# EAGLE design sensorboard_atm_rev1 (EAGLE 6.5.0)
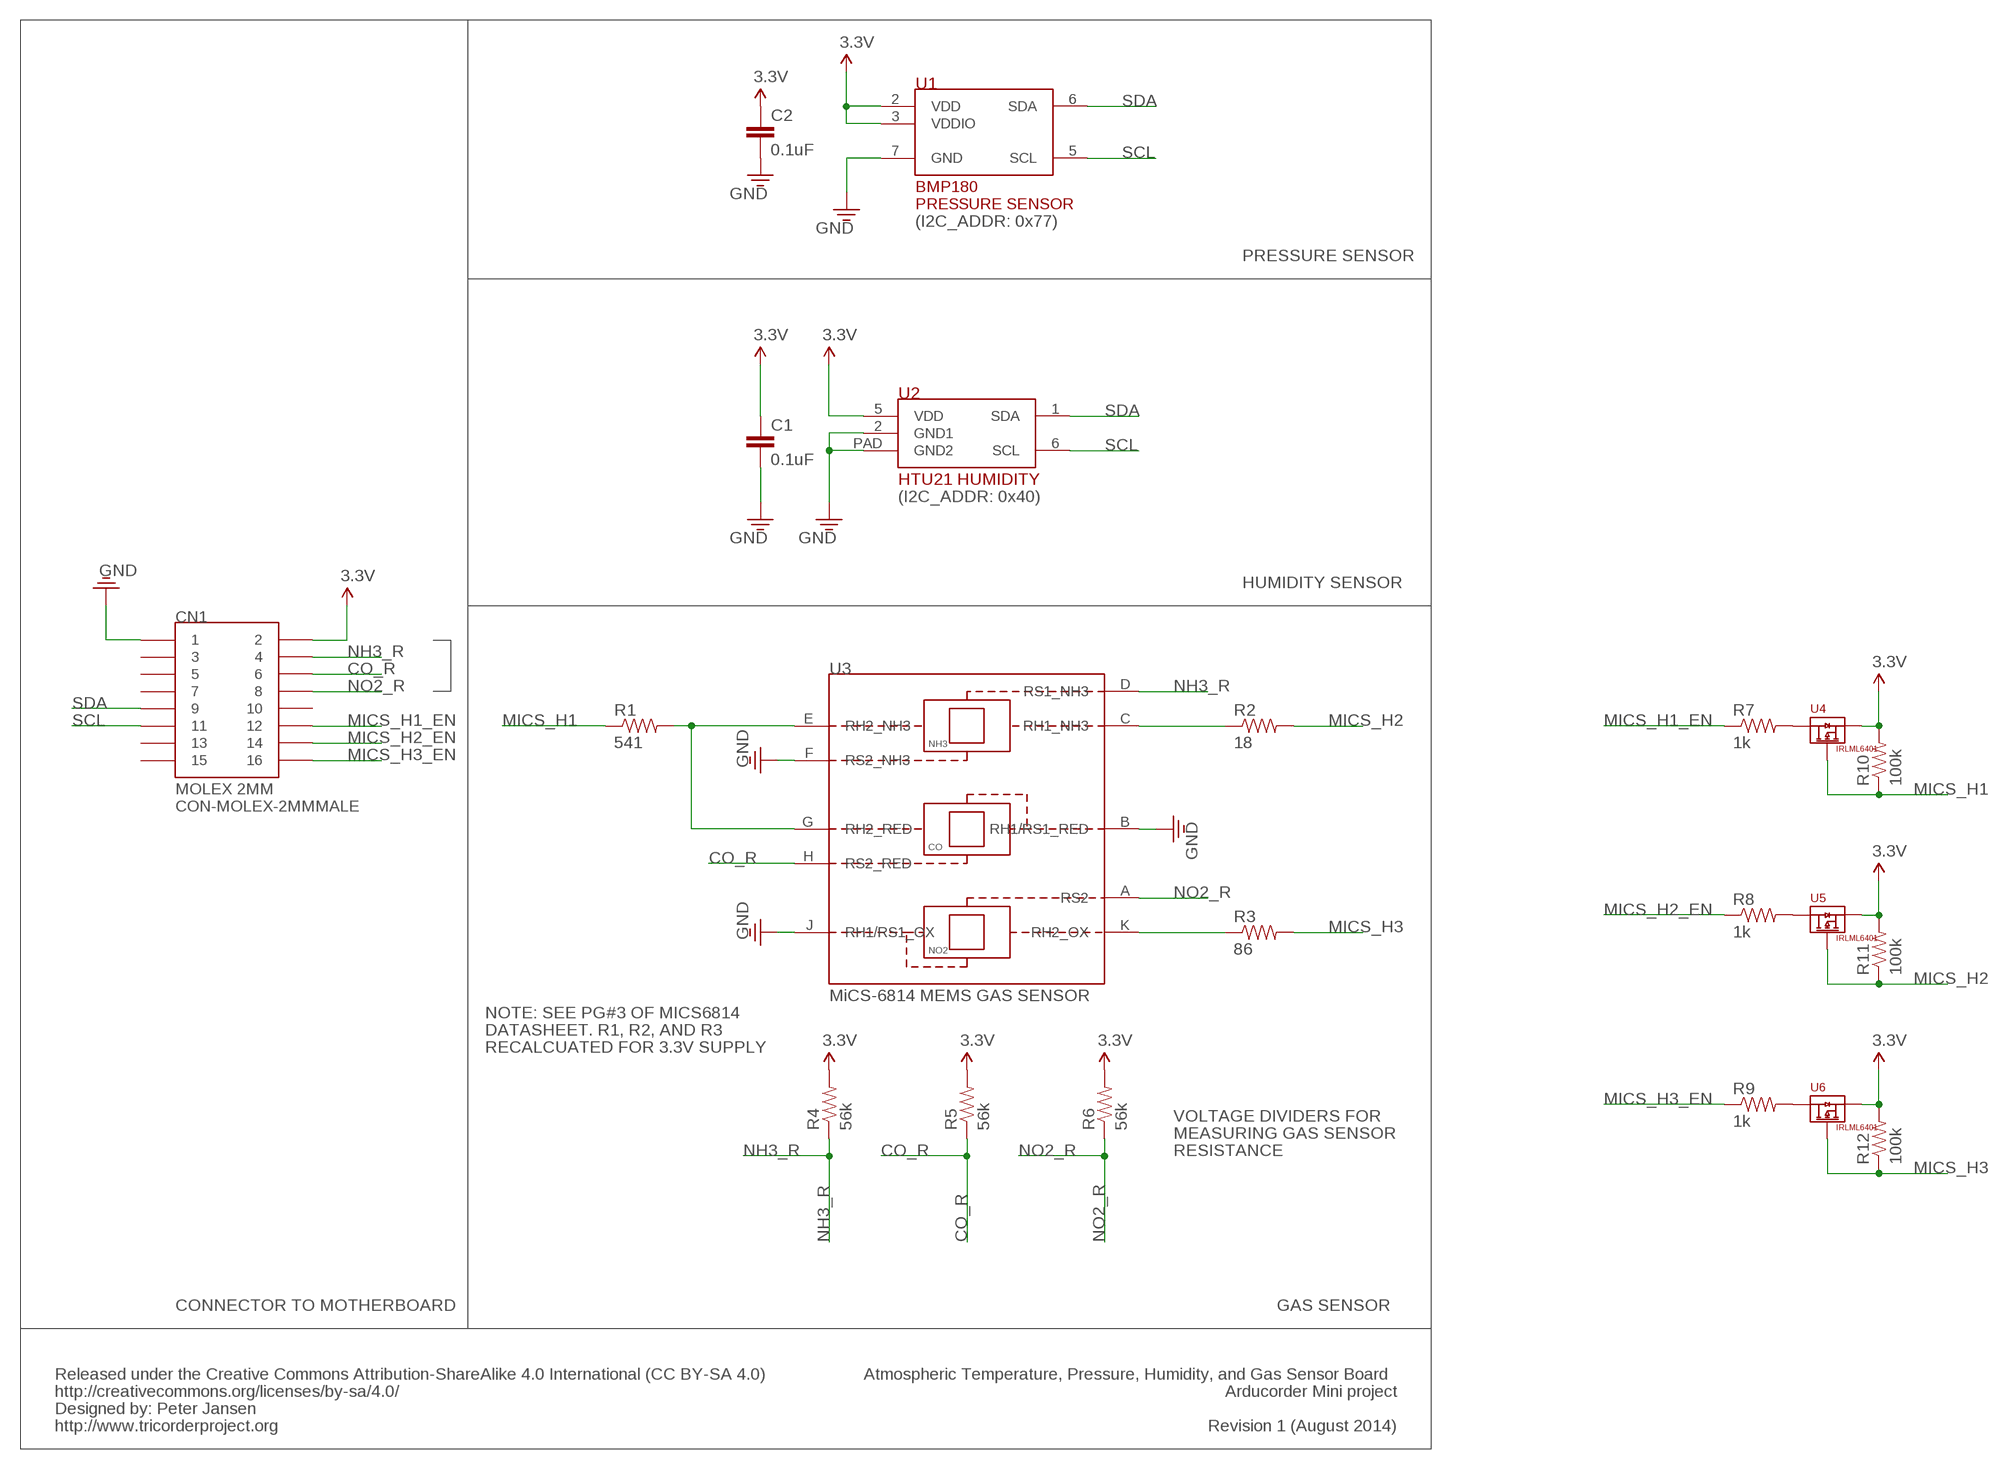
[diagram p0: schematic, sheet 1]

## Parts
C1  0.1uF  CAP0603  [0603]
C2  0.1uF  CAP0603  [0603]
CN1  CON-MOLEX-2MMMALE  [MOLEX-0877591650]
R1  541  RESISTOR0603  [0603]
R2  18  RESISTOR0603  [0603]
R3  86  RESISTOR0603  [0603]
R4  56k  RESISTOR0603  [0603]
R5  56k  RESISTOR0603  [0603]
R6  56k  RESISTOR0603  [0603]
R7  1k  RESISTOR0603  [0603]
R8  1k  RESISTOR0603  [0603]
R9  1k  RESISTOR0603  [0603]
R10  100k  RESISTOR0603  [0603]
R11  100k  RESISTOR0603  [0603]
R12  100k  RESISTOR0603  [0603]
U1  BMP180  [BMP180]
U2  HTU21D  [HTU21D]
U3  MICS-6814  [MICS-6814]
U4  MOSFET-IRLML6401  [SOT23-3L]
U5  MOSFET-IRLML6401  [SOT23-3L]
U6  MOSFET-IRLML6401  [SOT23-3L]

## Nets
3.3V: C1.1 C2.1 CN1.2 R4.2 R5.2 R6.2 R10.2 R11.2 R12.2 U1.2(VDD) U1.3(VDDIO) U2.5(VDD) U4.2(S) U5.2(S) U6.2(S)
CO_R: CN1.6 R5.1 U3.H(RS2_RED)
GND: C1.2 C2.2 CN1.1 U1.7(GND) U2.2(GND1) U2.PAD(GND2) U3.B(RH1/RS1_RED) U3.F(RS2_NH3) U3.J(RH1/RS1_OX)
MICS_H1: R1.1 R10.1 U4.1(G)
MICS_H1_EN: CN1.12 R7.1
MICS_H2: R2.2 R11.1 U5.1(G)
MICS_H2_EN: CN1.14 R8.1
MICS_H3: R3.2 R12.1 U6.1(G)
MICS_H3_EN: CN1.16 R9.1
N$4: R7.2 U4.3(D)
N$5: R8.2 U5.3(D)
N$6: R9.2 U6.3(D)
N$19: R1.2 U3.E(RH2_NH3) U3.G(RH2_RED)
N$24: R2.1 U3.C(RH1_NH3)
N$25: R3.1 U3.K(RH2_OX)
NH3_R: CN1.4 R4.1 U3.D(RS1_NH3)
NO2_R: CN1.8 R6.1 U3.A(RS2)
SCL: CN1.11 U1.5(SCL) U2.6(SCL)
SDA: CN1.9 U1.6(SDA) U2.1(SDA)
Unconnected: CN1.3 CN1.5 CN1.7 CN1.10 CN1.13 CN1.15

## Notes on the sheet
- (I2C_ADDR: 0x77)
- PRESSURE SENSOR
- (I2C_ADDR: 0x40)
- HUMIDITY SENSOR
- NOTE: SEE PG#3 OF MICS6814
- DATASHEET. R1, R2, AND R3
- RECALCUATED FOR 3.3V SUPPLY
- VOLTAGE DIVIDERS FOR
- MEASURING GAS SENSOR
- RESISTANCE
- CONNECTOR TO MOTHERBOARD | GAS SENSOR
- Released under the Creative Commons Attribution-ShareAlike 4.0 International (CC BY-SA 4.0) | Atmospheric Temperature, Pressure, Humidity, and Gas Sensor Board
- http://creativecommons.org/licenses/by-sa/4.0/ | Arducorder Mini project
- Designed by: Peter Jansen
- http://www.tricorderproject.org | Revision 1 (August 2014)

## Library data of the parts
C1 C2 = notes_mark5a:CAP: Capacitor Standard 0603 ceramic capacitor, and 0.1" leaded capacitor.
CN1 = notes-arducorder-mini:CON-MOLEX-2MM: Molex 2mm pitch connectors. (87368-1624, 0877591650)
R1-R12 = notes_mark5a:RESISTOR: Resistor Basic schematic elements and footprints for 0603, 1206, and PTH 1/10th watt (small) resistors.
U1 = notes_mark5a:BMP180: BMP180 Digital Pressure Sensor w/I2C interface
U2 = notes_mark5a:HTU21D: HTU21D Relative Humidity Sensor w/I2C interface
U3 = notes_mark5a:MICS-6814: SGX SensorTech MiCS-6814 MEMS Gas Sensor w/3 Indepedent Sensing Elements
U4-U6 = arducorder-mini:MOSFET-IRLML6401: IRLML6401 P-Channel MOSFET

## Net classes
1 supply: width 0.178 mm
3 usbvcc: width 0.61 mm, drill 0.508 mm, clearance 0.203 mm to class 0, clearance 0.254 mm
5 USB: width 0.14 mm

## Board
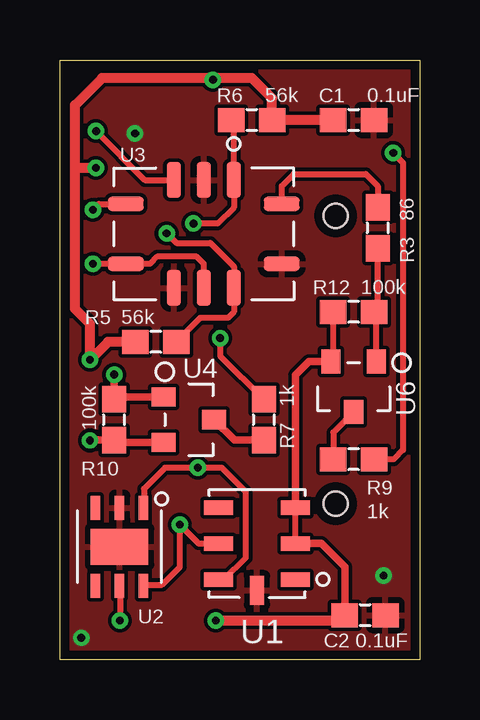
[diagram p1: board, top side]
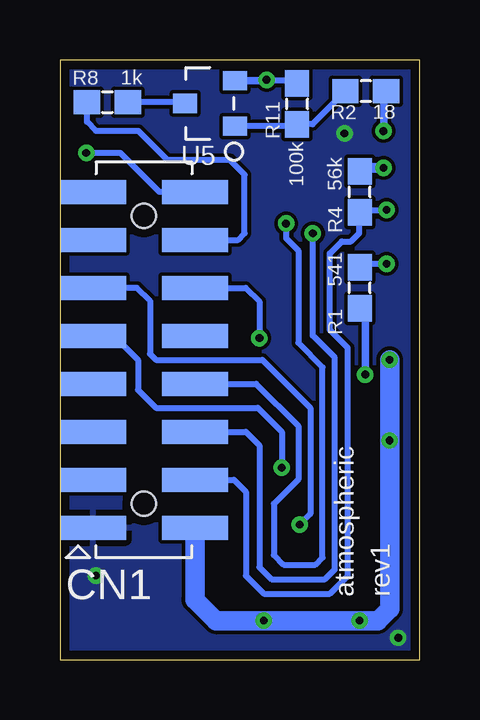
[diagram p2: board, bottom side, seen from below]

Size 15 x 25 mm. Coordinates in mm from the lower left corner, seen from the top.
Outline: 15,25 15,0 0,0 0,25 15,25
Copper layers (1*16): Top 0.0356mm / dielectric 1.5011mm / Bottom 0.0356mm
Design rules "default": minimum track width 6mil, minimum drill 13mil, track to track 6mil, track to pad 6mil, pad to pad 6mil, via to via 6mil, smd to smd 6mil, copper to edge 15mil, drill to drill 6mil, minimum pad ring 7mil, minimum via ring 7mil, stop-mask expansion 3mil, vias tented up to drill 0mil, thermal gap 10mil
tRestrict: area 92.5,49 to 94.5,55; area 90.5,36.5 to 94.5,44.5
bRestrict: area 92.5,48 to 94.5,56; area 90.5,34.5 to 94.5,46.5

### Footprints (pad centres in the part's own frame; a part is rotated, then mirrored left to right if it is on the bottom)
0603 = smd 1.1 x 1: 1 -0.85,0; 2 0.85,0
MOLEX-0877591650 = smd 1 x 2.75: 1 7,-2.125; 2 7,2.125; 3 5,-2.125; 4 5,2.125; 5 3,-2.125; 6 3,2.125; 7 1,-2.125; 8 1,2.125; 9 -1,-2.125; 10 -1,2.125; 11 -3,-2.125; 12 -3,2.125; 13 -5,-2.125; 14 -5,2.125; 15 -7,-2.125; 16 -7,2.125 | hole 1: -6,0; 6,0
BMP180 = smd 0.6 x 1.2: 1 -1.5,-1.6; 2 0,-1.6; 3 1.5,-1.6; 4 1.5,1.6; 5 0,1.6; 6 -1.5,1.6 | smd 1.2 x 0.6: 7 -1.95,0
HTU21D = smd 1 x 0.4: 1 1.625,-1; 2 1.625,0; 3 1.625,1; 4 -1.625,1; 5 -1.625,0; 6 -1.625,-1 | smd 1.5 x 2.4: PAD 0,0
MICS-6814 = smd 1.5 x 0.6: A 2.25,-1.25; B 2.25,0; C 2.25,1.25; F -2.25,1.25; G -2.25,0; H -2.25,-1.25 | smd 0.6 x 1.5: D 1.25,3.25; E -1.25,3.25; J -1.25,-3.25; K 1.25,-3.25
SOT23-3L = smd 0.8 x 1: 1 -0.95,-1.05; 2 0.95,-1.05; 3 0,1.05

### Placement (x,y rotation side)
C1  12.25,22.5 0 top
C2  12.73,1.85 0 top
CN1  11.5,12.5 270 bottom
R1  2.5,15.5 90 bottom
R2  2.24,23.7 180 bottom
R3  13.25,18 270 top
R4  2.5,19.5 90 bottom
R5  4,13.25 180 top
R6  8,22.5 0 top
R7  8.5,10 270 top
R8  13.02,23.24 0 bottom
R9  12.25,8.35 180 top
R10  2.25,10 270 top
R11  5.11,23.17 90 bottom
R12  12.25,14.5 180 top
U1  8.22,4.84 90 top
U2  2.49,4.71 90 top
U3  6,17.75 90 top
U4  5.38,10 270 top
U5  8.74,23.19 90 bottom
U6  12.25,11.38 180 top

### Tracks (layer width: path | path; a pad name or v marks a point on that pad's centre or on a via)
3.3V  (via drill 0.33)
  Top 0.254: U2.5 2.5,3.07 v2.5,1.62 | U1.2 U1.3 | U6.2 11.4,12.53 R12.2
  Top 0.305: U1.2 10.91,4.84 11.88,3.88 C2.1 | U4.2 2.35,9.05 R10.2 1.34,9.15 v1.25,9.14 | U1.3 9.82,11.87 10.38,12.43 U6.2 | v6.38,24.17 6.38,24.2 6.33,24.25
  Top 0.406: 0.62,20.5 0.62,14.62 1.25,14 v1.25,12.5 2,13.25 R5.2 | 0.62,20.5 0.62,23.12 1.75,24.25 6.33,24.25 8,24.25 8.85,23.4 R6.2 C1.1 | v6.5,1.62 11.75,1.62 C2.1 | v1.5,20.5 0.62,20.5
  Bottom 0.254: R11.2 5.22,24.14 U5.2
  Bottom 0.305: U5.2 6.42,24.14 v6.38,24.17
  Bottom 0.406: v1.5,20.5 2.35,20.5 R4.2
  Bottom 0.813: CN1.2 9.38,2.5 8.5,1.62 v6.5,1.62 v2.5,1.62 1.75,1.62 1.25,2.12 v1.25,9.14 v1.25,12.5
CO_R  (via drill 0.33)
  Top 0.254: R5.1 5.85,14.25 7,14.25 7.25,14.5 U3.H 7.25,16.39 6.28,17.37 4.86,17.37 v4.45,17.77
  Bottom 0.254: CN1.6 7.25,9.5 6.75,9 6.68,8.93 6.68,3.85 6.18,3.35 3.94,3.35 3.53,3.75 3.53,12.59 4.45,13.51 v4.45,17.77
GND  (via drill 0.33)
  other vias: 13.5,3.5 3.13,21.94 0.89,0.91
  pour Bottom: 15,25 15,0 0,0 0,25
  pour Top: 0,25 15,25 15,0 0,0
MICS_H1  (via drill 0.33)
  Top 0.305: v2.26,11.88 2.25,11.87 R10.1 2.35,10.95 U4.1
  Bottom 0.305: v2.26,11.88 2.26,14.41 R1.1
MICS_H1_EN  (via drill 0.33)
  Top 0.254: v6.68,13.4 6.68,12.67 R7.1
  Bottom 0.254: CN1.12 7.26,15.5 6.68,14.93 v6.68,13.4
MICS_H2
  Bottom 0.254: U5.1 5.19,22.24 R11.1 4.47,22.32 R2.2
MICS_H2_EN
  Bottom 0.254: CN1.14 7.57,17.5 7.29,17.77 7.29,20.21 7.9,20.82 10.51,20.82 11.73,22.04 13.49,22.04 13.87,22.42 R8.1
MICS_H3
  Top 0.254: U6.1 13.2,14.4 R12.1 13.25,14.65 R3.2
MICS_H3_EN  (via drill 0.33)
  Top 0.254: v13.9,21.12 14.3,20.72 14.3,8.73 13.93,8.35 R9.1
  Bottom 0.254: CN1.16 10.85,19.5 12.48,21.12 v13.9,21.12
  Bottom 0.305: CN1.16
N$4
  Top 0.305: U4.3 7.28,9.15 R7.2
N$5
  Bottom 0.254: U5.3 9.64,23.24 R8.2
N$6
  Top 0.254: U6.3 11.4,9.47 R9.2
N$19  (via drill 0.33)
  Top 0.254: v1.38,16.5 U3.E 3.75,16.5 4.05,16.8 5.7,16.8 6,16.5 U3.G
  Bottom 0.254: v1.38,16.5 2.35,16.5 R1.2
N$24  (via drill 0.33)
  Top 0.254: v1.5,22.04 3.54,20 U3.C
  Bottom 0.254: v1.5,22.04 v1.49,22.05
  Bottom 0.305: v1.49,22.05 1.49,23.59 R2.1
N$25
  Top 0.254: U3.K 9.25,19.75 9.75,20.25 12.75,20.25 13.25,19.75 R3.1
NH3_R  (via drill 0.33)
  Top 0.254: v1.38,18.75 1.62,19 U3.D
  Bottom 0.254: v1.38,18.75 2.6,18.75 arc90 R4.1 2.52,18.63 2.52,17.77 2.86,17.43 3.25,17.43 3.75,16.93 3.75,13.75 3,13 3,3.5 3.75,2.75 6.5,2.75 7.25,3.5 7.25,7 7.75,7.5 CN1.4
NO2_R  (via drill 0.33)
  Top 0.254: R6.1 arc-90 7.25,22.4 U3.A 7.25,18.85 6.58,18.18 v5.57,18.18
  Bottom 0.254: CN1.8 6.81,11.5 5.06,9.75 5.06,7.51 6.07,6.49 6.07,4.36 5.67,3.95 4.35,3.95 4.04,4.26 4.04,12.18 5.06,13.2 5.06,17.06 5.57,17.57 v5.57,18.18
SCL  (via drill 0.33)
  Top 0.254: U1.5 5.79,4.84 v5,5.62 5,3.88 4.25,3.12 3.53,3.12 U2.6
  Bottom 0.254: v5,5.62 4.55,6.07 4.55,10.5 6.55,12.5 11,12.5 11.25,12.75 11.25,14.97 11.78,15.5 CN1.11
SDA  (via drill 0.33)
  Top 0.254: U2.1 3.5,6.35 3.5,7.12 4.38,8 v5.75,8 6.75,8 7.75,7 7.75,4.25 6.84,3.34 U1.6
  Bottom 0.254: CN1.9 12.75,13.5 11.75,12.5 11.75,11.25 11,10.5 6.75,10.5 5.75,9.5 v5.75,8

### Text on the board
tPlace: U3 | U2 | C2 0.1uF
bPlace: rev1 | atmospheric